# EAGLE design YosanoLoveButton (EAGLE 7.7.0)
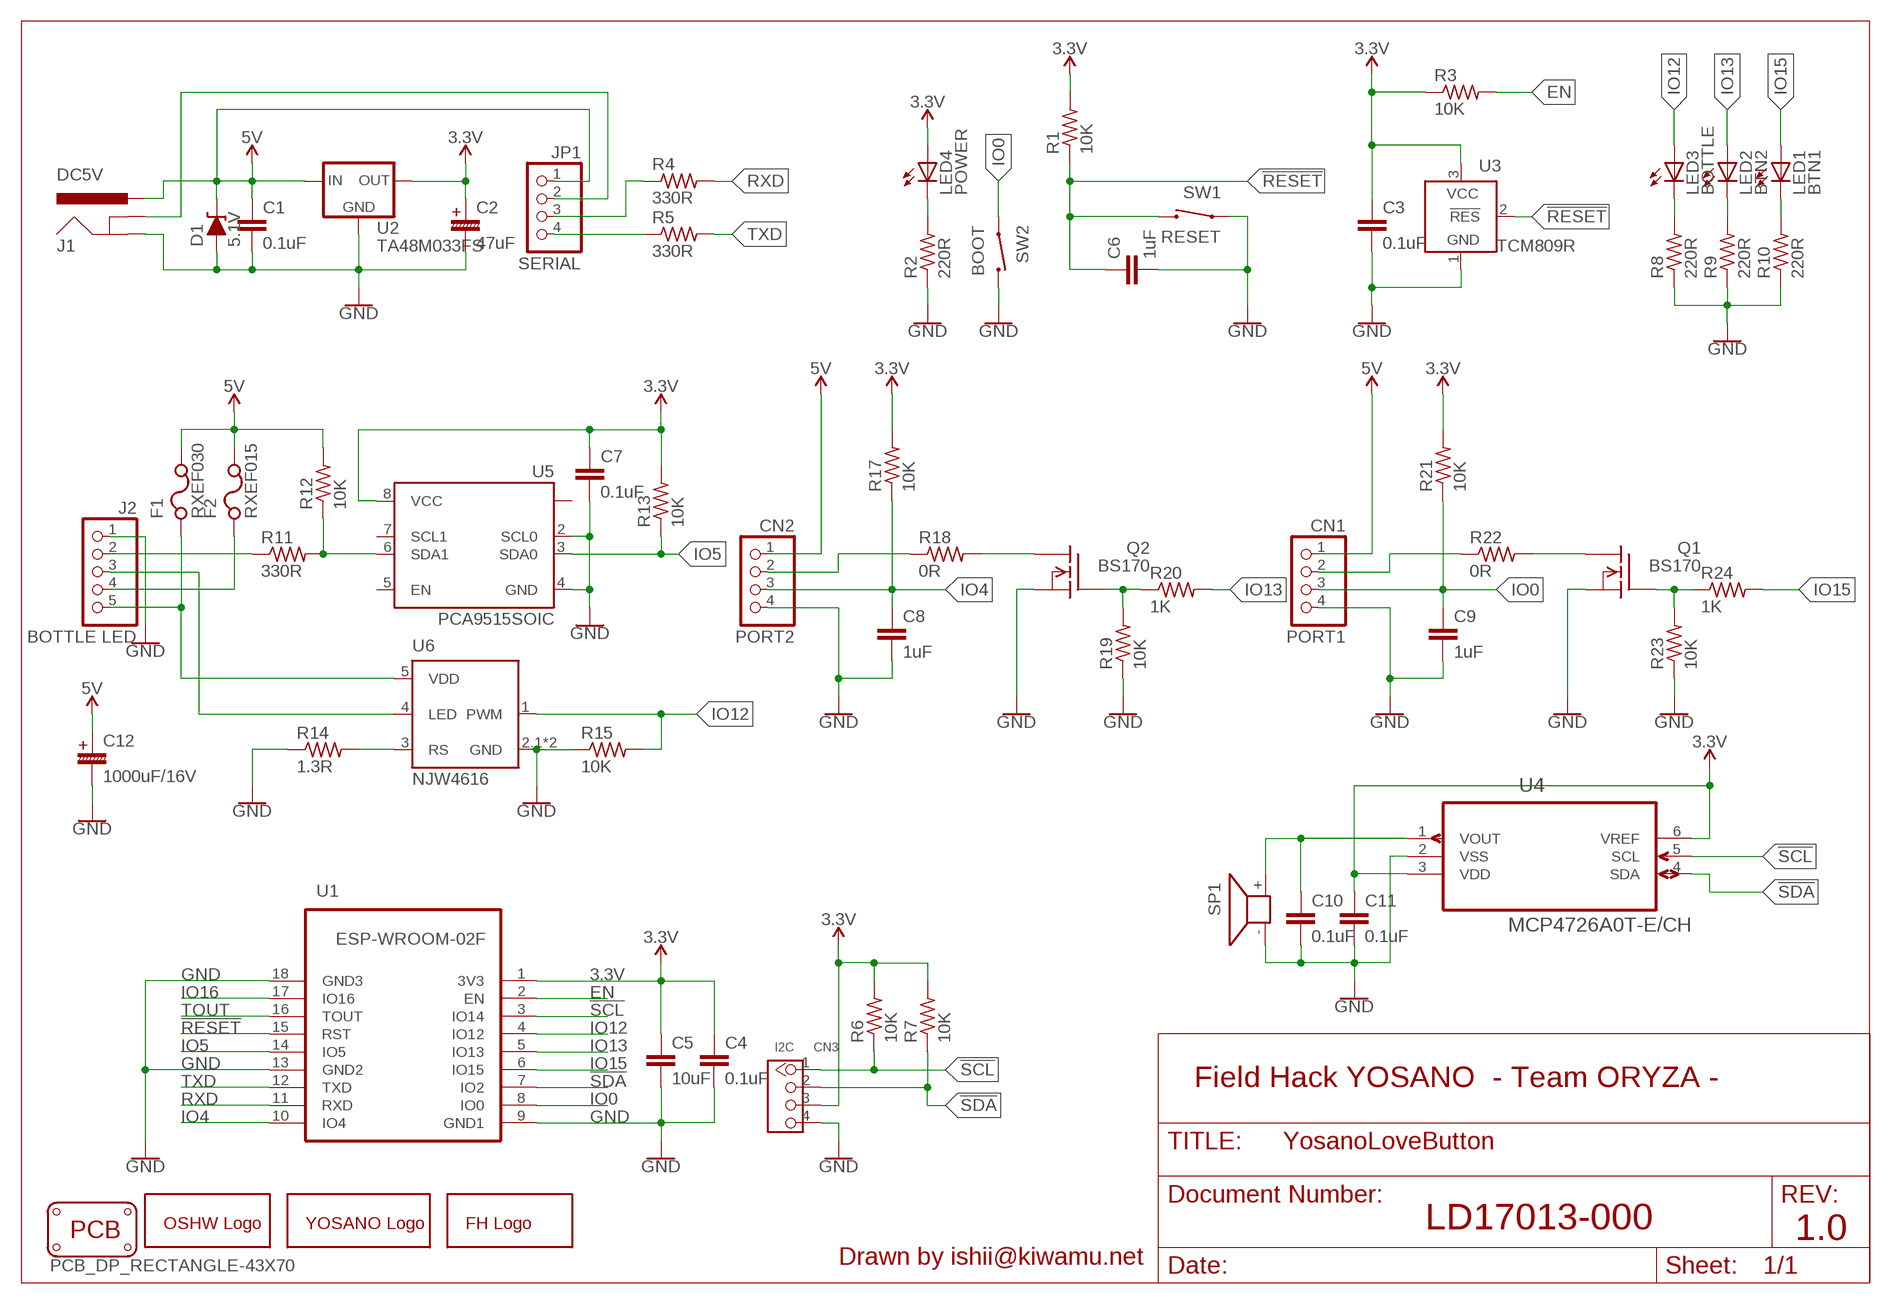
[diagram p0: schematic, sheet 1]

## Parts
C1  0.1uF  C5/2.5  [C5B2.5]
C2  47uF  C-PR-2,0X5  [E2,0-5]
C3  0.1uF  C5/2.5  [C5B2.5]
C4  0.1uF  C5/2.5  [C5B2.5]
C5  10uF  C5/2.5  [C5B2.5]
C6  1uF  C5/2.5  [C5B2.5]
C7  0.1uF  C5/2.5  [C5B2.5]
C8  1uF  C5/2.5  [C5B2.5]
C9  1uF  C5/2.5  [C5B2.5]
C10  0.1uF  C5/2.5  [C5B2.5]
C11  0.1uF  C5/2.5  [C5B2.5]
C12  1000uF/16V  C-PR-5,0X10  [E5,0-10]
CN1  PORT1  04-JST-XH-B4B-XH-A  [B4B-XH]
CN2  PORT2  04-JST-XH-B4B-XH-A  [B4B-XH]
CN3  I2C  GROVE-CONNECTOR-DIP(4P-2.0)  [HW4-2.0]
D1  5.1V  ZENER-DIODEZD-5LD  [ZDIO-5-LD]
F1  RXEF030  PTCPTH  [PTC-PTH]
F2  RXEF015  PTCPTH  [PTC-PTH]
GOLD_ORB_SM1  OSHWLOGOLOGO5MM  [OSHW_5MM]
J1  DC5V  POWER_JACK  [POWER_JACK_PTH]
J2  BOTTLE LED  MINIDIN-5P  [MD-50SM]
JP1  SERIAL  PINHD-1X4  [1X04]
LED1  BTN1  LED3MM  [LED3MM]
LED2  BTN2  LED3MM  [LED3MM]
LED3  BOTTLE  LED3MM  [LED3MM]
LED4  POWER  LED3MM  [LED3MM]
PCB1  PCB_DP_RECTANGLE-43X70  [DP7043_V1]
Q1  BS170  [TO92]
Q2  BS170  [TO92]
R1  10K  R-US_0204/5  [0204/5]
R2  220R  R-US_0204/5  [0204/5]
R3  10K  R-US_0204/5  [0204/5]
R4  330R  R-US_0204/5  [0204/5]
R5  330R  R-US_0204/5  [0204/5]
R6  10K  R-US_0204/5  [0204/5]
R7  10K  R-US_0204/5  [0204/5]
R8  220R  R-US_0204/5  [0204/5]
R9  220R  R-US_0204/5  [0204/5]
R10  220R  R-US_0204/5  [0204/5]
R11  330R  R-US_0204/5  [0204/5]
R12  10K  R-US_0204/5  [0204/5]
R13  10K  R-US_0204/5  [0204/5]
R14  1.3R  R-US_0204/5  [0204/5]
R15  10K  R-US_0204/5  [0204/5]
R17  10K  R-US_0204/5  [0204/5]
R18  0R  R-US_0204/5  [0204/5]
R19  10K  R-US_0204/5  [0204/5]
R20  1K  R-US_0204/5  [0204/5]
R21  10K  R-US_0204/5  [0204/5]
R22  0R  R-US_0204/5  [0204/5]
R23  10K  R-US_0204/5  [0204/5]
R24  1K  R-US_0204/5  [0204/5]
SP1  PKM13EPYH4000  [PKM13EPYH4000]
SW1  RESET  TVBP06  [TVBP06]
SW2  BOOT  TVBP06  [TVBP06]
U1  ESP-WROOM-02F  [FRONT-FACE]
U2  TA48M033FS  [HSIP3]
U3  TCM809R  TCM809  [SOT23B-3]
U4  MCP4726A0T-E/CH  [SOT95P270X145-6N]
U5  PCA9515SOIC  [SO08]
U6  NJW4616  [SOT-89-5]
U$1  YOSANOLOGO  [YOSANOCHO]
U$2  FHLOGO  [FIELDHACK-YOSANO]

## Nets
3.3V [pwr]: C2.+ C3.1 C4.1 C5.1 C7.1 C11.1 CN3.3 LED4.A R1.2 R3.1 R6.2 R7.2 R13.2 R17.2 R21.2 U1.1(3V3) U2.P$2(OUT) U3.3(VCC) U4.3(VDD) U4.6(VREF) U5.8(VCC)
5V [pwr]: C1.1 C12.+ CN1.1 CN2.1 D1.C F1.2 F2.2 J1.PWR JP1.1 R12.2 U2.P$1(IN)
!RESET: C6.1 R1.1 SW1.2 U1.15(RST) U3.2(!RES)
!SCL: CN3.1 R6.1 U1.3(IO14) U4.5(SCL)
!SDA: CN3.2 R7.1 U1.7(IO2) U4.4(SDA)
EN: R3.2 U1.2(EN)
GND [gnd]: C1.2 C2.- C3.2 C4.2 C5.2 C6.2 C7.2 C8.2 C9.2 C10.2 C11.2 C12.- CN1.4 CN2.4 CN3.4 D1.A J1.GND J2.1 Q1.1(S) Q2.1(S) R2.1 R8.1 R9.1 R10.1 R14.1 R15.1 R19.1 R23.1 SP1.- SW1.1 SW2.2 U1.9(GND1) U1.13(GND2) U1.18(GND3) U2.P$3(GND) U3.1(GND) U4.2(VSS) U5.2(SCL0) U5.4(GND) U6.2.1(GND) U6.2.2(GND)
IO0: C9.1 CN1.3 R21.1 SW2.1 U1.8(IO0)
IO4: C8.1 CN2.3 R17.1 U1.10(IO4)
IO5: R13.1 U1.14(IO5) U5.3(SDA0)
IO12: LED3.A R15.2 U1.4(IO12) U6.1(PWM)
IO13: LED2.A R20.2 U1.5(IO13)
IO15: LED1.A R24.2 U1.6(IO15)
IO16: U1.17(IO16)
N$1: LED3.K(C) R8.2
N$2: LED4.K(C) R2.2
N$3: JP1.4 R5.1
N$4: R14.2 U6.3(RS)
N$5: JP1.3 R4.1
N$6: LED2.K(C) R9.2
N$7: LED1.K(C) R10.2
N$8: F1.1 J2.5 U6.5(VDD)
N$9 [gnd]: J2.3 U6.4(LED)
N$10 [gnd]: J1.GNDBREAK JP1.2
N$11: Q2.3(D) R18.2
N$12: J2.2 R11.1
N$13: CN2.2 R18.1
N$14: Q2.2(G) R19.2 R20.1
N$15: Q1.3(D) R22.2
N$16: C10.1 SP1.+ U4.1(VOUT)
N$17: F2.1 J2.4
N$18: Q1.2(G) R23.2 R24.1
N$19: CN1.2 R22.1
N$20: R11.2 R12.1 U5.6(SDA1)
RXD: R4.2 U1.11(RXD)
TOUT: U1.16(TOUT)
TXD: R5.2 U1.12(TXD)
Unconnected: U5.1(N.C.) U5.5(EN) U5.7(SCL1)

## Notes on the sheet
- Field Hack YOSANO  - Team ORYZA -
- LD17013-000
- 1.0
- Drawn by ishii@kiwamu.net

## Library data of the parts
C1 C3-C9 = capacitor-wima:C: CAPACITOR naming: grid - package width
C2 C12 = YosanoLoveButton:C-PR: POLARIZED ELECTROLYTIC/TANTALUM
C10 C11 = YosanoLoveButton:C: CAPACITOR naming: grid - package width; MF: 株式会社村田製作所(muRata); MPN: RDER72E104K2K1H03B; OC_AKIZUKI: P-10147
CN1 CN2 = YosanoLoveButton:04-JST-XH: JST CONNECTOR
CN3 = Seeed-Connector -2016:GROVE-CONNECTOR-DIP(4P-2.0): 320110033; VALUE: 4P-2.0
D1 = YosanoLoveButton:ZENER-DIODE: Z-Diode
F1 F2 = YosanoLoveButton:PTC: Resettable Fuse PTC Resettable Fuse. Spark Fun Electronics SKU : COM-08357
GOLD_ORB_SM1 = YosanoLoveButton:OSHWLOGO: The OSHW logo for PCB layout
J1 = SparkFun-Connectors:POWER_JACK: Power Jack Connector This is the standard 5.5mm barrel jack for power. The PTH is the most common, proven, reliable, footprint. The Slot footprint only works if the mill layer is transmitted to the PCB fab house so be warned. Here are the connectors we sell at SparkFun: DC Barrel Power Jack/Connector <https://www.sparkfun.com/products/119> (PRT-00119) DC Barrel Power Jack/Connector (SMD) <https://www.sparkfun.com/products/12748> (PRT-12748) DC Barrel Jack Adapter - Breadboard Compatible <https://www.sparkfun.com/products/10811> (PRT-10811) It is used on this SparkFun product (and many, many others): SparkFun RedBoard - Programmed with Arduino <https://www.sparkfun.com/products/12757> (DEV-12757) Also, if you need a mating power supply or connector, please check these out: Wall Adapter Power Supply - 9VDC 650mA <https://www.sparkfun.com/products/298> (TOL-00298) DC Barrel Jack Adapter - Male <https://www.sparkfun.com/products/10287> (PRT-10287); PROD_ID: CONN-08197
J2 = YosanoLoveButton:MINIDIN-5P; MF: CUI; MPN: MD-50SM; OC_DIGIKEY: CP-2250-ND; OC_MOUSER: 490-MD-50SM; PACKAGE: MINIDIN-5P
JP1 = pinhead:PINHD-1X4: PIN HEADER
LED1-LED4 = adafruit:LED: LED OSRAM: - CHIPLED LG R971, LG N971, LY N971, LG Q971, LY Q971, LO R971, LY R971 LH N974, LH R974 LS Q976, LO Q976, LY Q976 LO Q996 - Hyper CHIPLED LW Q18S LB Q993, LB Q99A, LB R99A - SideLED LS A670, LO A670, LY A670, LG A670, LP A670 LB A673, LV A673, LT A673, LW A673 LH A674 LY A675 LS A676, LA A676, LO A676, LY A676, LW A676 LS A679, LY A679, LG A679 - Hyper Micro SIDELED® LS Y876, LA Y876, LO Y876, LY Y876 LT Y87S - SmartLED LW L88C, LW L88S LB L89C, LB L89S, LG L890 LS L89K, LO L89K, LY L89K LS L896, LA L896, LO L896, LY L896 - TOPLED LS T670, LO T670, LY T670, LG T670, LP T670 LSG T670, LSP T670, LSY T670, LOP T670, LYG T670 LG T671, LOG T671, LSG T671 LB T673, LV T673, LT T673, LW T673 LH T674 LS T676, LA T676, LO T676, LY T676, LB T676, LH T676, LSB T676, LW T676 LB T67C, LV T67C, LT T67C, LS T67K, LO T67K, LY T67K, LW E67C LS E67B, LA E67B, LO E67B, LY E67B, LB E67C, LV E67C, LT E67C LW T67C LS T679, LY T679, LG T679 LS T770, LO T770, LY T770, LG T770, LP T770 LB T773, LV T773, LT T773, LW T773 LH T774 LS E675, LA E675, LY E675, LS T675 LS T776, LA T776, LO T776, LY T776, LB T776 LHGB T686 LT T68C, LB T68C - Hyper Mini TOPLED® LB M676 - Mini TOPLED Santana® LG M470 LS M47K, LO M47K, LY M47K Source: http://www.osram.convergy.de/
PCB1 = YosanoLoveButton:PCB_DP_RECTANGLE: Dangerous Prototypes Standard Rectangular PCB sizes
Q1 Q2 = YosanoLoveButton:BS170: Silicon N Channel MOS FET High Speed Power Switching 250V; 0.4A; TO-92; MF: FAIRCHILD; MPN: BS170; OC_AKIZUKI: I-09724; PACKAGE: TO-92
R1-R15 R17-R24 = YosanoLoveButton:R-US_: RESISTOR, American symbol
SP1 = YosanoLoveButton:PKM13EPYH4000: SPEAKER Source: Schukat; MF: muRata; MPN: PKM13EPYH4000; OC_AKIZUKI: P-04118
SW1 SW2 = switches:TVBP06: 2pin switch. http://akizukidenshi.com/catalog/g/gP-08074/
U1 = YosanoLoveButton:ESP-WROOM-02: WiFi module - ESP-WROOM-02; MF: Espressif; MPN: ESP-WROOM-02; OC_AKIZUKI: M-9607; OC_SENGOKU: EEHD-4SH8; OC_SWITCHSCIENCE: 2346
U2 = YosanoLoveButton:TA48M*: TA48 series; MF: 株式会社東芝セミコンダクター社(TOSHIBA); MPN: TA48M033F(S Q); OC_AKIZUKI: I-00538; PACKAGE: HSIP3
U3 = telcom:TCM809: POWER SUPPLY MONITOR replacement for Maxim MAX809 and MAX810; MF: MICROCHIP; MPN: TCM809MENB713; OC_FARNELL: 9762744; OC_NEWARK: 96K3998
U4 = YosanoLoveButton:MCP4726A0T-E/CH: 12-Bit Digital-to-Analog Converter with EEPROM; MF: Microchip; MPN: MCP4725A0T-E/CH; OC_AKIZUKI: I-07611; PACKAGE: SOT-23-6
U5 = YosanoLoveButton:PCA9515
U6 = YosanoLoveButton:NJW4616
U$1 = YosanoLoveButton:YOSANOLOGO
U$2 = YosanoLoveButton:FHLOGO

## Net classes
0 default: width 0.406 mm, drill 0.305 mm, clearance 0.254 mm
1 gnd: width 0.61 mm, drill 0.61 mm, clearance 0.305 mm
2 pwr: width 0.559 mm, drill 0.559 mm, clearance 0.305 mm

## Board
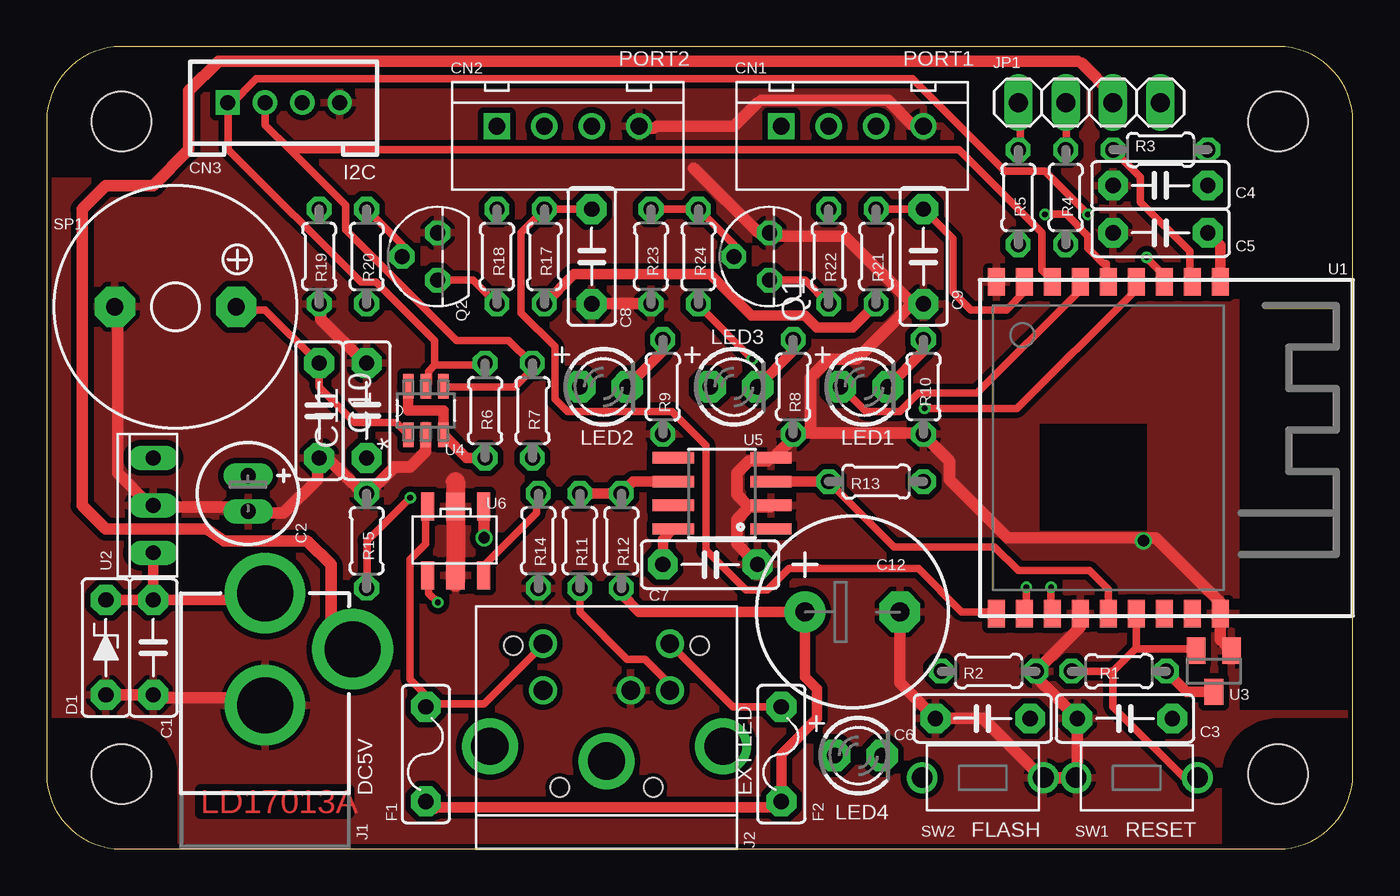
[diagram p1: board, top side]
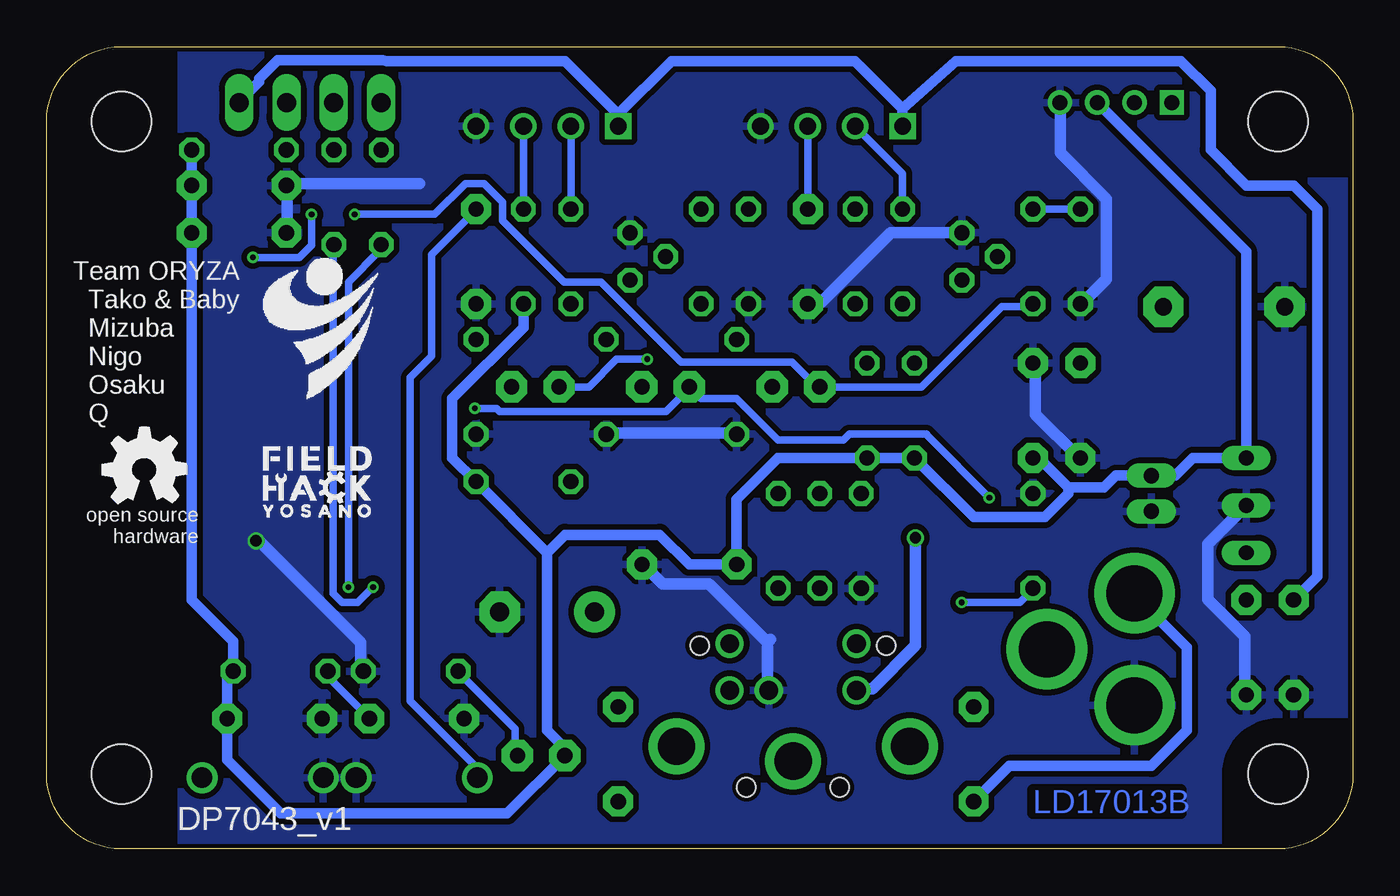
[diagram p2: board, bottom side, seen from below]

Size 70 x 43 mm. Coordinates in mm from the lower left corner, seen from the top.
Copper layers (1*16): Top 0.035mm / dielectric 1.5mm / Bottom 0.035mm
Design rules "SeeedStudio_2layer_DRU_no_angle_20140221": minimum track width 6mil, minimum drill 12mil, track to track 6mil, track to pad 6mil, pad to pad 6mil, via to via 6mil, smd to smd 0mil, copper to edge 10mil, drill to drill 10mil, minimum pad ring 10mil, minimum via ring 6mil, stop-mask expansion 2mil, vias tented up to drill 100mil, thermal gap 10mil

### Footprints (pad centres in the part's own frame; a part is rotated, then mirrored left to right if it is on the bottom)
C5B2.5 = drill 0.813 pad 1.6 octagon: 1 -2.54,0; 2 2.54,0
E2,0-5 = drill 0.813 long: + -0.953,0; - 0.953,0
E5,0-10 = drill 1.016 pad 2.184: + -2.54,0 | drill 1.016 pad 2.184 octagon: - 2.54,0
B4B-XH = drill 0.9 square: 1 -3.81,0 | drill 0.9: 2 -1.27,0; 3 1.27,0; 4 3.81,0
HW4-2.0 = drill 0.8 pad 1.27 square: 1 -3,0 | drill 0.8 pad 1.27: 2 -1,0; 3 1,0; 4 3,0
ZDIO-5-LD = drill 0.813 pad 1.6 octagon: A 2.54,0; C -2.54,0
PTC-PTH = drill 0.813 pad 1.6 octagon: 1 -2.54,0; 2 2.54,0
POWER_JACK_PTH = drill 2.997 pad 4.318: GND 0,7.7; GNDBREAK 4.7,10.7; PWR 0,13.7
MD-50SM = drill 1: 1 -1.3,-8.5; 2 -3.4,-8.5; 3 3.4,-8.5; 4 -3.4,-11; 5 3.4,-11 | drill 2: P$1 0,-4.7; P$2 -6.25,-5.5; P$3 6.25,-5.5 | hole 1: 2.5,-3.3; -2.5,-3.3; -5,-10.9; 5,-10.9
1X04 = drill 1.016 long: 1 -3.81,0; 2 -1.27,0; 3 1.27,0; 4 3.81,0
LED3MM = drill 0.813 pad 1.676 octagon: A -1.27,0; K 1.27,0
DP7043_V1 = hole 3.2: 4,4; 66,4; 66,39; 4,39
TO92 = drill 0.813 octagon: 1 1.27,0; 2 0,1.905; 3 -1.27,0
0204/5 = drill 0.813 octagon: 1 -2.54,0; 2 2.54,0
PKM13EPYH4000 = drill 0.914 pad 2.159 octagon: + 3.251,0; - -3.251,0
TVBP06 = drill 1.1: 1 -3.25,0; 2 3.25,0
FRONT-FACE = smd 1.485 x 0.9: 1 -8.893,4.9; 2 -8.893,3.4; 3 -8.893,1.9; 4 -8.893,0.4; 5 -8.893,-1.1; 6 -8.893,-2.6; 7 -8.893,-4.1; 8 -8.893,-5.6; 9 -8.893,-7.1; 10 8.893,-7.1; 11 8.893,-5.6; 12 8.893,-4.1; 13 8.893,-2.6; 14 8.893,-1.1; 15 8.893,0.4; 16 8.893,1.9; 17 8.893,3.4; 18 8.893,4.9
HSIP3 = drill 0.8 long: P$1 -2.54,0; P$2 2.54,0; P$3 0,0
SOT23B-3 = smd 1 x 1.4: 1 -0.95,-1.1; 2 0.95,-1.1; 3 0,1.1
SOT95P270X145-6N = smd 1.321 x 0.559: 1 -1.295,0.94; 2 -1.295,0; 3 -1.295,-0.94; 4 1.295,-0.94; 5 1.295,0; 6 1.295,0.94
SO08 = smd 0.61 x 2.21: 1 -1.905,-2.616; 2 -0.635,-2.616; 3 0.635,-2.616; 4 1.905,-2.616; 5 1.905,2.616; 6 0.635,2.616; 7 -0.635,2.616; 8 -1.905,2.616
SOT-89-5 = smd 0.7 x 1.5: 1 -1.5,-1.85; 3 1.5,-1.85; 4 1.5,1.85; 5 -1.5,1.85 | smd 1 x 1.5: 2.1 0,-1.85; 2.2 0,1.85

### Placement (x,y rotation side)
C1  5.71,10.79 270 top
C2  10.79,19.05 270 top
C3  57.78,6.99 180 top
C4  59.69,35.56 180 top
C5  59.69,33.02 180 top
C6  50.16,6.99 180 top
C7  35.56,15.24 0 top
C8  29.21,31.75 270 top
C9  46.99,31.75 270 top
C10  14.61,23.5 270 top
C11  17.14,23.5 90 top
C12  43.18,12.7 0 top
CN1  43.18,38.73 0 top
CN2  27.94,38.73 0 top
CN3  12.7,40.01 0 top
D1  3.17,10.79 270 top
F1  20.32,5.08 270 top
F2  39.37,5.08 270 top
GOLD_ORB_SM1  64.77,20.32 0 bottom
J1  11.7,0 0 top
J2  30,0 180 top
JP1  55.88,40.01 180 top
LED1  43.81,24.77 0 top
LED2  29.84,24.77 0 top
LED3  36.83,24.77 0 top
LED4  43.5,5 0 top
PCB1  0,0 0 top
Q1  38.73,31.75 90 top
Q2  20.95,31.75 90 top
R1  57.47,9.53 0 top
R2  50.48,9.53 180 top
R3  59.69,37.47 180 top
R4  54.61,34.92 270 top
R5  52.07,34.92 270 top
R6  23.5,23.5 270 top
R7  26.04,23.5 270 top
R8  40.01,24.77 90 top
R9  33.02,24.77 90 top
R10  46.99,24.77 90 top
R11  28.57,16.51 90 top
R12  30.8,16.51 270 top
R13  44.45,19.68 0 top
R14  26.35,16.51 90 top
R15  17.14,16.51 270 top
R17  26.67,31.75 270 top
R18  24.13,31.75 270 top
R19  14.61,31.75 90 top
R20  17.14,31.75 270 top
R21  44.45,31.75 270 top
R22  41.91,31.75 270 top
R23  32.38,31.75 90 top
R24  34.92,31.75 270 top
SP1  6.91,29.05 0 top
SW1  58.42,3.81 0 top
SW2  50.16,3.81 0 top
U1  58,21.5 270 top
U2  5.71,18.41 90 top
U3  62.55,9.53 180 top
U4  20.32,23.5 90 top
U5  36.2,19.05 90 top
U6  21.91,16.51 0 top
U$1  58.42,24.13 0 bottom
U$2  58.42,17.78 0 bottom

### Tracks (layer width: path | path; a pad name or v marks a point on that pad's centre or on a via)
3.3V
  Top 0.559: U5.8 33.02,16.59 C7.1 | U3.3 61.11,8.43 R1.2 | U1.1 62.9,32.35 C5.1 | U4.6 19.37,24.78 19.37,23.5 21.27,23.5 21.26,23.48 U4.3 22.5,20.95 R6.2 | R21.2 43.18,27.94 41.27,27.94 40.64,28.57 37.78,28.57 35.56,30.8 28.26,30.8 R17.2
  Bottom 0.559: C11.1 16.83,20.95 15.24,19.37 | 15.24,19.37 13.34,19.37 12.7,20 C2.+ 9.53,20 8.57,20.95 U2.P$2 5.71,32.02 CN3.3 | R21.2 44.45,27.94 48.26,24.13 48.26,20.95 R13.2 43.18,15.88 | 43.18,15.88 43.18,6.35 42.23,5.4 LED4.A 45.33,1.91 57.47,1.91 60.33,4.76 C3.1 60.33,9.21 R1.2 60.01,11.11 62.23,13.34 C5.1 C4.1 R3.1 | 43.18,15.88 42.23,16.83 37.15,16.83 35.56,15.24 C7.1 33.02,18.73 30.8,20.95 R7.2 R6.2 20.32,17.78 16.51,17.78 15.24,19.05 15.24,19.37
5V
  Top 0.559: D1.C C1.1 | C1.1 U2.P$1 | C1.1 11.34,13.34 J1.PWR | R12.2 30.8,13.65 31.75,12.7 C12.+ 40.64,9.21 41.27,8.57 41.27,6.99 39.37,5.08 F2.2 39.05,2.22 20.95,2.22 20.8,2.15 20.47,2.48 F1.2 20.14,2.64
  Bottom 0.559: D1.C 1.91,14.61 1.91,34.29 3.17,35.56 5.71,35.56 7.62,37.47 7.62,40.64 9.21,42.23 21.27,42.23 24.13,39.69 | 24.13,39.69 CN2.1 | 24.13,39.69 26.67,42.23 36.51,42.23 39.37,39.37 | 39.37,39.37 CN1.1 | 39.37,39.37 42.23,42.23 51.75,42.23 52.01,42.27 57.62,42.27 58.61,41.27 58.61,41.11 59.6,40.12 JP1.1 | F1.2 18.41,4.45 10.79,4.45 8.89,6.35 8.89,10.79 11.43,13.34 J1.PWR
!RESET
  Top 0.406: 58.4,11.45 U1.15 58.4,10.78 | 58.4,10.78 57.15,9.53 | 57.15,9.53 R1.1 | SW1.2 60.96,3.81 57.15,7.62 57.15,9.53 | U3.2 61.58,10.73 58.45,10.73 58.4,10.78
  Bottom 0.406: R1.1 54.93,9.21 C6.1
!SCL  (via drill 0.3)
  Top 0.406: U1.3 59.77,30.38 59.69,30.3 | 59.77,30.21 U1.3 | 20.8,25.92 20.47,25.59 20.47,24.93 U4.5 | 20.8,25.92 23.44,25.92 R6.1 | 20.8,25.92 20.8,27.24 17.67,30.38 16.84,30.38 9.74,37.48 9.74,39.95 CN3.1 9.91,39.95 11.23,41.27 46.39,41.27 51.35,36.32 53.49,36.32 v55.8,34.01 | v58.94,31.7 59.77,30.87 59.77,30.54 U1.3
  Bottom 0.406: v58.94,31.7 56.46,31.7 55.8,32.36 v55.8,34.01
!SDA
  Top 0.406: U4.4 21.29,24.77 25.08,24.77 26.04,25.72 R7.1 25.92,26.09 24.77,27.24 21.96,27.24 16.02,33.19 16.02,34.51 13.06,37.47 | U1.7 53.82,30.54 53.34,31.03 53.34,33.02 48.9,37.47 13.06,37.47 | 13.06,37.47 11.72,38.8 11.72,39.95 CN3.2
  Bottom 0.406: 26.09,26.09 R7.1
EN
  Top 0.406: 61.25,30.54 U1.2 | 61.25,30.71 U1.2 | U1.2 61.25,30.87 61.25,32.03 58.61,34.67 58.61,35.99 57.29,37.31 R3.2
GND  (via drill 0.61)
  Top 0.61: U3.1 62.9,11.22 U1.18 62.9,12.88 62.9,13.21 59.44,16.68 58.78,16.68 | U1.13 55.4,11.9 R2.1 53.02,9.21 C3.2 55.24,3.88 SW1.1 SW2.2 53.49,3.8 53.34,3.81 50.16,6.99 C6.2 45.72,8.89 C12.- | 34.67,36.49 38.14,33.02 Q1.1 38.96,32.85 42.76,32.85 46.39,29.22 46.89,29.22 C9.2 46.23,29.06 43.42,26.25 41.94,26.25 40.95,25.26 40.95,22.29 | 32.52,38.63 31.86,38.63 CN2.4 | 58.78,16.68 51.51,16.68 48.37,19.81 48.37,20.8 47.05,22.12 R10.1 46.72,22.29 40.95,22.29 | 37.64,18.33 38.8,18.33 U5.2 | 37.64,18.33 36.98,17.67 36.98,16.34 37.97,15.35 C7.2 | 37.64,18.33 36.98,18.99 36.98,20.14 37.64,20.8 38.63,20.8 U5.4 38.96,20.97 40.12,22.12 R8.1 40.28,22.29 40.95,22.29 | v58.78,16.51 58.78,16.68 | R23.1 32.36,29.22 29.22,29.22 C8.2 | 15.85,39.95 CN3.4 | 20.8,33.02 Q2.1 | D1.A C1.2 5.94,8.09 11.23,8.09 11.56,7.76 J1.GND | R19.1 14.69,29.06 14.69,28.4 17,26.09 C11.2 | 17.17,18.99 18.66,20.47 19.48,20.47 20.31,21.3 20.31,22.12 U4.2 | 17,18.99 15.19,20.8 14.69,20.8 C10.2 14.53,20.64 14.53,19.81 12.71,18 11.06,18 C2.- 10.57,18.33 5.78,18.33 U2.P$3 5.45,18.49 3.8,20.14 3.8,28.89 SP1.- | 38.3,40.12 45.07,40.12 46.39,38.8 46.72,38.8 CN1.4 | 32.7,38.73 36.83,38.73 38.1,40.01
  Top 1.016: 21.91,19.68 21.91,14.29
  Bottom 0.61: 50.02,35.66 57.12,35.66 C4.2 57.12,35.33 57.12,33.02 C5.2 | 47.05,38.63 CN1.4 | R2.1 53.16,9.58 53.16,11.06 58.69,16.59 v58.78,16.51 | R9.1 33.02,22.29 39.95,22.29 R8.1 | 31.37,11.06 31.37,8.59 J2.1 | 31.37,11.06 34.51,14.2 36.98,14.2 37.97,15.19 C7.2 | Q2.1 24.77,33.02 28.56,29.22 29.06,29.22 C8.2 | C11.2 17,25.92 17,23.28 14.69,20.97 C10.2 | C1.2 5.78,8.26 5.78,11.39 7.76,13.37 7.76,16.34 5.78,18.33 U2.P$3 | CN3.4 15.68,39.95 15.68,37.31 13.21,34.84 13.21,30.54 14.53,29.22 R19.1 | 31.2,11.23 31.37,11.06
  pour Top: 0,0 69.85,0 69.85,43.18 0,43.18
  pour Bottom: 0,0 69.85,0 69.85,43.18 0,43.18
IO0
  Top 0.406: R21.1 C9.1 48.58,32.7 48.58,29.84 49.53,28.89 51.44,28.89 52.4,29.86 U1.8
  Bottom 0.406: CN1.3 R21.1 | SW2.1 47.05,3.96 47.05,4.46 50.52,7.92 50.52,25.26 49.37,26.42 49.37,31.86 47.05,34.18 C9.1
IO4
  Top 0.406: C8.1 R17.1 26.58,34.18 25.43,33.02 25.43,28.73 27.24,26.91 27.24,24.11 27.9,23.44 33.52,23.44 35.33,21.63 35.33,16.02 37.48,13.87 38.63,13.87 39.79,15.02 46.72,15.02 49.03,12.71 50.85,12.71 U1.10
  Bottom 0.406: CN2.3 C8.1
IO5
  Top 0.406: U1.14 56.9,13.9 55.88,14.92 52.07,14.92 50.8,16.19 45.4,16.19 R13.1
  Top 0.559: U5.3 R13.1
IO12  (via drill 0.3)
  Top 0.406: v47.05,23.61 52.01,23.61 58.28,29.88 58.28,30.38 U1.4 | v20.97,13.21 20.47,13.7 20.47,14.53 U6.1 | v19.48,18.82 17.17,16.51 17.17,14.03 R15.2
  Bottom 0.406: v47.05,23.61 45.9,23.61 45.73,23.44 36.82,23.44 35.66,24.6 LED3.A 34.92,24.13 33.02,24.13 30.8,21.91 27.3,21.91 26.99,22.23 22.86,22.23 22.78,22.12 v19.48,18.82 | v20.97,13.21 17.83,13.21 17.17,13.87 R15.2
IO13  (via drill 0.3)
  Top 0.406: U1.5 56.79,30.54 56.79,31.37 56.63,31.37 55.8,32.19 55.8,32.85 54.65,34.01 v53.49,34.01
  Bottom 0.406: R20.2 17.17,29.06 18.82,29.06 23.11,24.77 LED2.A 28.73,24.77 30.05,26.09 35.99,26.09 40.28,30.38 42.27,30.38 45.57,33.68 45.57,34.67 46.56,35.66 47.55,35.66 49.2,34.01 v53.49,34.01
IO15  (via drill 0.3)
  Top 0.406: v37.81,26.25 35,29.06 R24.2 | U1.6 55.31,30.38 55.31,29.88 49.86,24.43 46.72,24.43 45.73,23.44 43.92,23.44 42.6,24.77 LED1.A
  Bottom 0.406: v37.81,26.25 39.46,26.25 40.95,24.77 LED1.A
N$1
  Top 0.559: LED3.K 40.01,26.67 R8.2
N$2
  Bottom 0.406: R2.2 47.88,9.41 44.91,6.44 44.91,5.12 LED4.K
N$3
  Top 0.406: R5.1 52.17,37.48 52.17,39.95 JP1.4
N$4
  Top 0.406: 23.44,14.69 U6.3 23.44,14.86 23.44,15.19 26.25,18 26.25,18.82 R14.2 26.25,18.99
N$5
  Top 0.406: R4.1 54.65,37.48 54.65,39.95 JP1.3
N$6
  Top 0.559: LED2.K 33.02,26.67 R9.2
N$7
  Top 0.559: LED1.K 46.99,26.67 R10.2
N$8
  Top 0.406: J2.5 26.58,10.9 23.44,7.76 20.47,7.76 F1.1 | 20.31,17.83 20.31,18.33 U6.5 20.31,17.67 20.31,16.34 19.48,15.52 19.48,9.08 20.47,8.09 F1.1 | 20.47,7.92 F1.1
N$9  (via drill 0.61)
  Top 0.61: v23.44,16.68 23.44,18.33 U6.4
  Bottom 0.61: v23.44,16.68 23.44,10.9 25.76,8.59 26.58,8.59 J2.3
N$10
  Top 0.61: J1.GNDBREAK 15.67,11.43 15.24,11.43 15.24,15.24 13.97,16.51 9.53,16.51 8.57,17.14 3.17,17.14 1.91,18.41 1.91,34.29 3.17,35.56 5.71,35.56 7.62,37.47 7.62,40.64 9.21,42.23 55.24,42.23 55.47,42.1 57.12,40.45 57.12,40.12 JP1.2
N$11
  Top 0.406: R18.2 22.86,30.48 Q2.3
N$12
  Top 0.406: R11.1 28.57,12.7 31.11,10.16 32.07,10.16 33.4,8.83 J2.2
N$13
  Bottom 0.406: CN2.2 24.13,36.2 R18.1
N$14
  Top 0.406: R20.1 19.05,32.38 Q2.2
  Bottom 0.406: R19.2 R20.1
N$15
  Top 0.406: Q1.3 40.64,30.48 R22.2
N$16
  Top 0.406: U4.1 18.72,22.86 16.51,22.86 14.61,24.77 C10.1 14.53,26.09 11.72,28.89 10.24,28.89 SP1.+
N$17
  Top 0.406: J2.4 36.78,7.62 F2.1
N$18
  Top 0.406: R23.2 R24.1 36.83,32.38 Q1.2
N$19
  Bottom 0.406: CN1.2 R22.1
N$20
  Top 0.559: U5.6 31.43,19.68 R12.1 R11.2
RXD  (via drill 0.3)
  Top 0.406: v52.5,14.03 52.5,12.71 U1.11
  Bottom 0.406: v52.5,14.03 53.33,13.21 54.15,13.21 54.65,13.7 54.65,32.36 R4.2
TXD  (via drill 0.3)
  Top 0.406: v53.82,14.03 53.82,12.71 U1.12
  Bottom 0.406: v53.82,14.03 53.82,30.38 52.17,32.03 52.17,32.36 R5.2

### Text on the board
Top: LD17013A
Bottom: LD17013B
tNames: I2C | DC5V | EXT LED | FLASH | RESET
bNames: Team ORYZA / Tako & Baby / Mizuba / Nigo / Osaku / Q